# Altium project high_voltage_controller.PrjPcb (part 5 of 5)
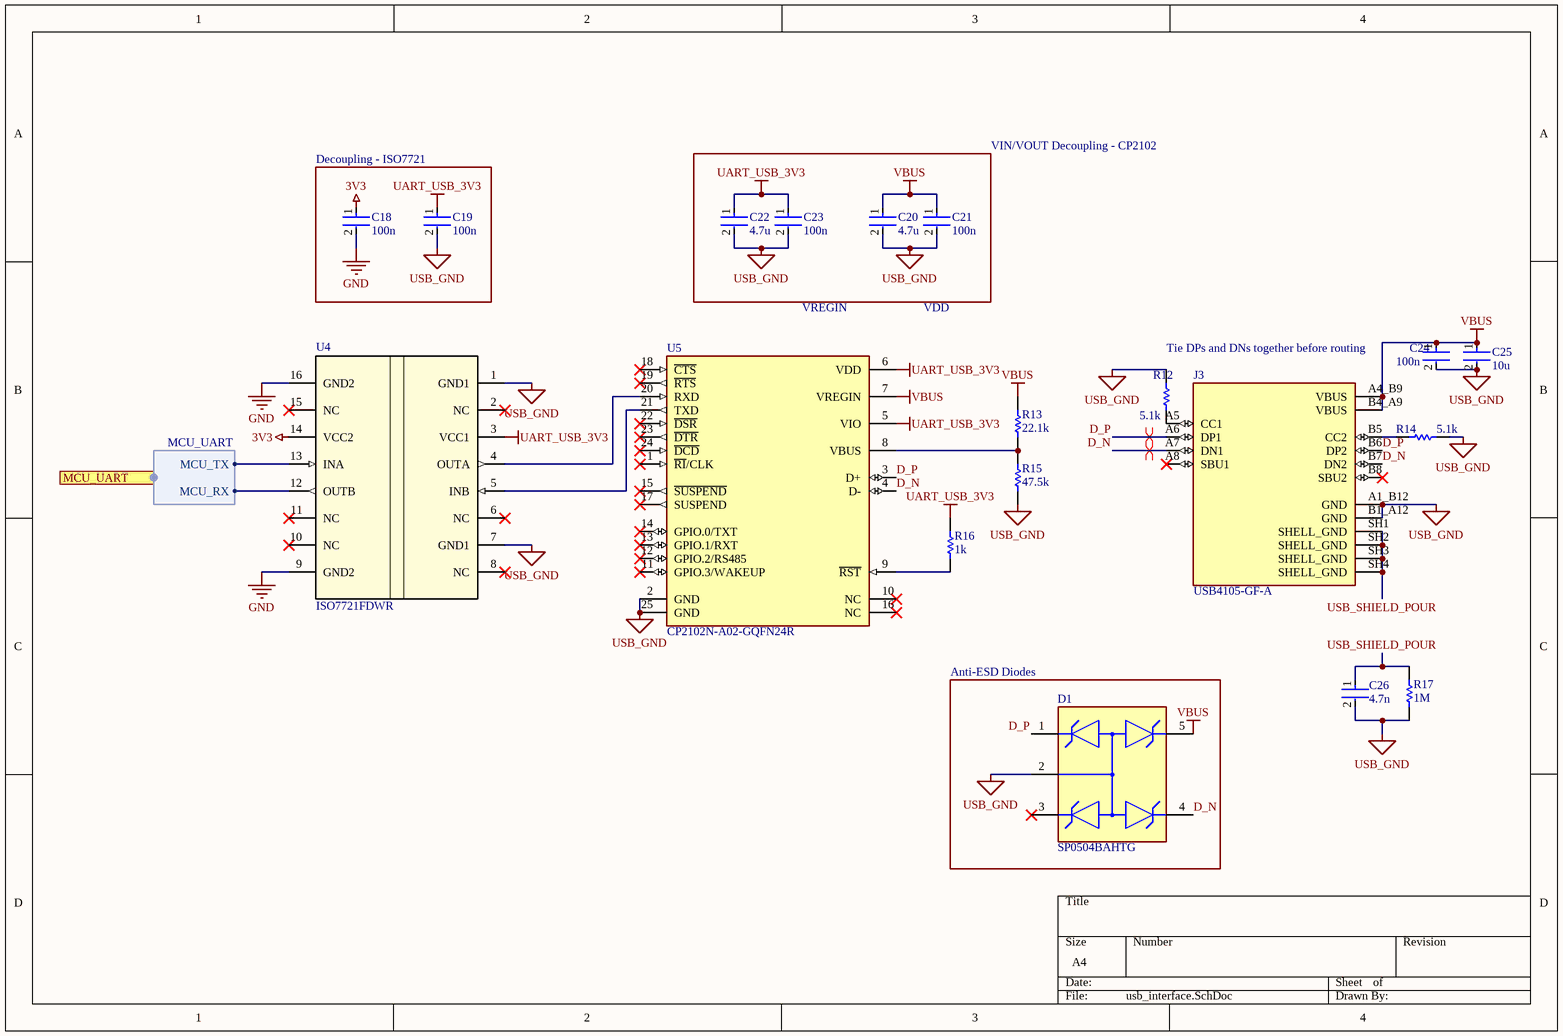
[diagram p7: usb_interface.SchDoc]

## Sheet usb_interface.SchDoc (continued)

### Library data of the parts (continued)
R17 = RC0805FR-071ML: 125mW Thick Film Resistors 150V ±100ppm/℃ ±1% 1MΩ 0805 Chip Resistor - Surface Mount ROHS; Manufacturer: Yageo Group; Temperature Coefficient: 100ppm/°C; Supplier: DigiKey; Supplier Part Number: 311-1.00MCRCT-ND; Manufacturer Part Number: RC0805FR-071ML; RoHS: Compliant; Category: Chip SMD Resistors; Stock: 235812; Pricing: 1=0.1, 10=0.034, 25=0.0256, 50=0.0208, 100=0.0171, 250=0.01344, 500=0.01136, 1000=0.00973 (USD); Case/Package: 0805; Case Code (Imperial): 0805; China RoHS: Non-Compliant; Composition: Thick Film; Contact Plating: Tin; Country of Origin: Mainland China, Taiwan; Depth: 1.25mm; Export Control Classification Number (ECCN) Code: EAR99; Features: Moisture Resistant; Height: 500µm; Harmonized Tariff Schedule (HTS) Code: 8533.21.00.30; Introduction Date: 2004-09-22; Lead Free: Lead Free; Length: 2mm; Lifecycle Status: Production; Max Operating Temperature: 155°C; Max Power Dissipation: 125mW; Military Standard: Not; Min Operating Temperature: -55°C; Mounting Technology: Surface Mount; Pins: 2; Number of Terminals: 2; Number of Terminations: 2; Packaging: Tape & Reel; Power Rating: 125mW; Radiation Hardening: No; REACH SVHC: Yes; Value: 1MΩ; Schedule B: 8533210045, 8533210045|8533210045, 8533210045|8533210045|8533210045, 8533210045|8533210045|8533210045|8533210045; Termination: SMD/SMT; Tolerance: 1%; Voltage Rating: 150V; Voltage Rating (AC): 150V; Voltage Rating (DC): 150V; Width: 1.25mm; Working Voltage: 150V; ComponentLink1URL: https://datasheet.octopart.com:443/RC0805FR-071ML-Yageo-datasheet-175887523.pdf?src-supplier=IHS; ComponentLink1Description: https://datasheet.octopart.com:443/RC0805FR-071ML-Yageo-datasheet-175887523.pdf?src-supplier=IHS; ComponentLink2URL: https://datasheet.octopart.com:443/RC0805FR-071ML-Yageo-datasheet-103092701.pdf?src-supplier=Upverter; ComponentLink2Description: https://datasheet.octopart.com:443/RC0805FR-071ML-Yageo-datasheet-103092701.pdf?src-supplier=Upverter; ComponentLink3URL: https://datasheet.octopart.com:443/RC0805FR-071ML-Yageo-datasheet-79472498.pdf?src-supplier=Upverter; ComponentLink3Description: https://datasheet.octopart.com:443/RC0805FR-071ML-Yageo-datasheet-79472498.pdf?src-supplier=Upverter; ComponentLink4URL: https://datasheet.octopart.com:443/RC0805FR-071ML-Yageo-datasheet-8330313.pdf?src-supplier=element14+APAC; ComponentLink4Description: https://datasheet.octopart.com:443/RC0805FR-071ML-Yageo-datasheet-8330313.pdf?src-supplier=element14+APAC; ComponentLink5URL: https://datasheet.octopart.com:443/RC0805FR-071ML-Yageo-Group-datasheet-190305687.pdf?src-supplier=Future+Electronics; ComponentLink5Description: https://datasheet.octopart.com:443/RC0805FR-071ML-Yageo-Group-datasheet-190305687.pdf?src-supplier=Future+Electronics; ComponentLink6URL: https://datasheet.octopart.com:443/RC0805FR-071ML-Yageo-datasheet-164759695.pdf?src-supplier=Future+Electronics; ComponentLink6Description: https://datasheet.octopart.com:443/RC0805FR-071ML-Yageo-datasheet-164759695.pdf?src-supplier=Future+Electronics; ComponentLink7URL: https://datasheet.octopart.com:443/RC0805FR-071ML-Yageo-datasheet-127823281.pdf?src-supplier=Future+Electronics; ComponentLink7Description: https://datasheet.octopart.com:443/RC0805FR-071ML-Yageo-datasheet-127823281.pdf?src-supplier=Future+Electronics; ComponentLink8URL: https://datasheet.octopart.com:443/RC0805FR-071ML-Yageo-datasheet-137700087.pdf?src-supplier=Future+Electronics; ComponentLink8Description: https://datasheet.octopart.com:443/RC0805FR-071ML-Yageo-datasheet-137700087.pdf?src-supplier=Future+Electronics; ComponentLink9URL: https://datasheet.octopart.com:443/RC0805FR-071ML-Yageo-datasheet-12592811.pdf?src-supplier=Future+Electronics; ComponentLink9Description: https://datasheet.octopart.com:443/RC0805FR-071ML-Yageo-datasheet-12592811.pdf?src-supplier=Future+Electronics; ComponentLink10URL: https://datasheet.octopart.com:443/RC0805FR-071ML-Yageo-datasheet-8324252.pdf?src-supplier=Future+Electronics; ComponentLink10Description: https://datasheet.octopart.com:443/RC0805FR-071ML-Yageo-datasheet-8324252.pdf?src-supplier=Future+Electronics; ComponentLink11URL: https://datasheet.octopart.com:443/RC0805FR-071ML-Yageo-datasheet-62067350.pdf?src-supplier=Farnell; ComponentLink11Description: https://datasheet.octopart.com:443/RC0805FR-071ML-Yageo-datasheet-62067350.pdf?src-supplier=Farnell; ComponentLink12URL: https://datasheet.octopart.com:443/RC0805FR-071ML-Yageo-datasheet-13691069.pdf?src-supplier=Farnell; ComponentLink12Description: https://datasheet.octopart.com:443/RC0805FR-071ML-Yageo-datasheet-13691069.pdf?src-supplier=Farnell; ComponentLink13URL: https://datasheet.octopart.com/RC0805FR-071ML-Yageo-datasheet-73766026.pdf; ComponentLink13Description: https://datasheet.octopart.com/RC0805FR-071ML-Yageo-datasheet-73766026.pdf; ComponentLink14URL: https://datasheet.octopart.com:443/RC0805FR-071ML-Yageo-datasheet-118657.pdf?src-supplier=DigiKey; ComponentLink14Description: https://datasheet.octopart.com:443/RC0805FR-071ML-Yageo-datasheet-118657.pdf?src-supplier=DigiKey; ComponentLink15URL: https://datasheet.octopart.com:443/RC0805FR-071ML-Yageo-datasheet-502840.pdf?src-supplier=element14; ComponentLink15Description: https://datasheet.octopart.com:443/RC0805FR-071ML-Yageo-datasheet-502840.pdf?src-supplier=element14; ComponentLink16URL: http://sigma.octopart.com:80/conflict_mineral_statement/Yageo-company-3.pdf?src-supplier=Compliance+Statements; ComponentLink16Description: http://sigma.octopart.com:80/conflict_mineral_statement/Yageo-company-3.pdf?src-supplier=Compliance+Statements; ComponentLink17URL: http://sigma.octopart.com:80/rohs_statement/Yageo-company-2.pdf?src-supplier=Compliance+Statements; ComponentLink17Description: http://sigma.octopart.com:80/rohs_statement/Yageo-company-2.pdf?src-supplier=Compliance+Statements; Supplier 1: DigiKey; Supplier Part Number 1: 311-1.00MCRCT-ND
U4 = ISO7721FDWR: Robust EMC, dual-channel, 1/1, reinforced digital isolator 16-SOIC -55 to 125; Manufacturer: Texas Instruments; Manufacturer Lifecycle Status: ACTIVE; Number of Channels: 2; Supplier: DigiKey; Supplier Part Number: 296-50346-1-ND; Manufacturer Part Number: ISO7721FDWR; RoHS: Compliant; Category: Digital Isolators; Stock: 15127; Pricing: 1=2.81, 10=2.094, 25=1.9152, 100=1.719, 250=1.62544, 500=1.5912 (USD); Case/Package: SOIC; Height: 2.65mm; Length: 10.3mm; Lifecycle Status: Production; Max Operating Temperature: 125°C; Min Operating Temperature: -55°C; Pins: 16; Schedule B: 8542390000; Thickness: 2.35mm; Width: 7.5mm; ComponentLink1URL: https://sigma.octopart.com:443/99572200/technical_drawing/Texas-Instruments-ISO7721FDWR.pdf?src-supplier=Texas+Instruments; ComponentLink1Description: https://sigma.octopart.com:443/99572200/technical_drawing/Texas-Instruments-ISO7721FDWR.pdf?src-supplier=Texas+Instruments; ComponentLink2URL: https://octopart.com:443/opatz8j6/c1?t=WZGGJDtRhiNR6xegtZ0Vzw6Jo8gIA4OkeL83hLNHBc3xALLZrOPA1KnNx-ec0I_-l9PCMZWyk75e5H8g6RMrJLmMNblHietK_abbQyImjN_oP_YsooAsDmW-v19do6DZ4jzx_Fx10KWDm9m_aOouo5hdul-hNs1fyUCmYsyFAGwxgQVoL5HSj0hs2mmPUZ1tA5owilxFZB39lP5Z4zu9Z-zIWmlA_gcYXWOi0ejZsd6FGsUjnxzOjqnuUWppL6xj46YVsAzbwlJm8vaSz28l_1Pzc2Ovu0xt7ToOzTyA-3S1SSaUiJRJiBHsaq__PSD3_uPcVRWFFlJ45olTYWRTRE-pIoFVMvQ4rQZJrKrEDyxEsTd4Z0hpONkN6dpwLsYRK33xwkk&src-supplier=Texas+Instruments; ComponentLink2Description: https://octopart.com:443/opatz8j6/c1?t=WZGGJDtRhiNR6xegtZ0Vzw6Jo8gIA4OkeL83hLNHBc3xALLZrOPA1KnNx-ec0I_-l9PCMZWyk75e5H8g6RMrJLmMNblHietK_abbQyImjN_oP_YsooAsDmW-v19do6DZ4jzx_Fx10KWDm9m_aOouo5hdul-hNs1fyUCmYsyFAGwxgQVoL5HSj0hs2mmPUZ1tA5owilxFZB39lP5Z4zu9Z-zIWmlA_gcYXWOi0ejZsd6FGsUjnxzOjqnuUWppL6xj46YVsAzbwlJm8vaSz28l_1Pzc2Ovu0xt7ToOzTyA-3S1SSaUiJRJiBHsaq__PSD3_uPcVRWFFlJ45olTYWRTRE-pIoFVMvQ4rQZJrKrEDyxEsTd4Z0hpONkN6dpwLsYRK33xwkk&src-supplier=Texas+Instruments; ComponentLink3URL: https://sigma.octopart.com:443/49250197/technical_drawing/Texas-Instruments-ISO7721FDWR.pdf?src-supplier=Texas+Instruments; ComponentLink3Description: https://sigma.octopart.com:443/49250197/technical_drawing/Texas-Instruments-ISO7721FDWR.pdf?src-supplier=Texas+Instruments; ComponentLink4URL: https://datasheet.octopart.com:443/ISO7721FDWR-Texas-Instruments-datasheet-164414773.pdf?src-supplier=Augswan; ComponentLink4Description: https://datasheet.octopart.com:443/ISO7721FDWR-Texas-Instruments-datasheet-164414773.pdf?src-supplier=Augswan; ComponentLink5URL: https://datasheet.octopart.com:443/ISO7721FDWR-Texas-Instruments-datasheet-82513802.pdf?src-supplier=HQonline; ComponentLink5Description: https://datasheet.octopart.com:443/ISO7721FDWR-Texas-Instruments-datasheet-82513802.pdf?src-supplier=HQonline; ComponentLink6URL: http://sigma.octopart.com:80/reach_statement/Texas-Instruments-company-64.pdf?src-supplier=Compliance+Statements; ComponentLink6Description: http://sigma.octopart.com:80/reach_statement/Texas-Instruments-company-64.pdf?src-supplier=Compliance+Statements; ComponentLink7URL: http://sigma.octopart.com:80/conflict_mineral_statement/Texas-Instruments-company-63.pdf?src-supplier=Compliance+Statements; ComponentLink7Description: http://sigma.octopart.com:80/conflict_mineral_statement/Texas-Instruments-company-63.pdf?src-supplier=Compliance+Statements; Supplier 1: DigiKey; Supplier Part Number 1: 296-50346-1-ND
U5 = CP2102N-A02-GQFN24R: IC Usb to Uart Bridge QFN24 / Usb Bridge, Usb to Uart Usb 2.0 Uart Interface 24-QFN (4X4); Manufacturer: Silicon Lab; Manufacturer Lifecycle Status: FULL PRODUCTION; Data Rate: 1.5Mbps; Max Junction Temperature (Tj): 105°C; Max Supply Voltage: 3.6V; Min Supply Voltage: 3V; Nominal Supply Voltage (DC): 3.3V; Number of Digital IO: 4; Supplier: DigiKey; Supplier Part Number: 336-5888-1-ND; Manufacturer Part Number: CP2102N-A02-GQFN24R; RoHS: Compliant; Category: USB Interface ICs; Stock: 19089; Pricing: 1=4.89, 10=3.699, 25=3.402, 100=3.0755, 250=2.9198, 500=2.82596 (USD); Ambient Temperature Range High: 85°C; China RoHS: Compliant; Height: 800µm; Height - Seated (Max): 800µm; Harmonized Tariff Schedule (HTS) Code: 8542.31.00.30; Interface: UART; Introduction Date: 2019-03-12; Length: 4mm; Lifecycle Status: Production; Max Operating Temperature: 85°C; Min Operating Temperature: -40°C; Number of Terminals: 24; REACH SVHC: Yes; Schedule B: 8542390000, 8542390000|8542390000|8542390000|8542390000|8542390000; Temperature Grade: Industrial; Terminal Pitch: 500µm; Width: 4mm; ComponentLink1URL: https://datasheet.octopart.com:443/CP2102N-A02-GQFN24R-Silicon-Labs-datasheet-138898368.pdf?src-supplier=SHENGYU+ELECTRONICS; ComponentLink1Description: https://datasheet.octopart.com:443/CP2102N-A02-GQFN24R-Silicon-Labs-datasheet-138898368.pdf?src-supplier=SHENGYU+ELECTRONICS; ComponentLink2URL: https://datasheet.octopart.com:443/CP2102N-A02-GQFN24R-Silicon-Labs-datasheet-166051788.pdf?src-supplier=Burklin+Elektronik; ComponentLink2Description: https://datasheet.octopart.com:443/CP2102N-A02-GQFN24R-Silicon-Labs-datasheet-166051788.pdf?src-supplier=Burklin+Elektronik; Supplier 1: DigiKey; Supplier Part Number 1: 336-5888-1-ND

## Sheet power.SchDoc
size A4; SheetNumber: 4; SheetTotal: 5
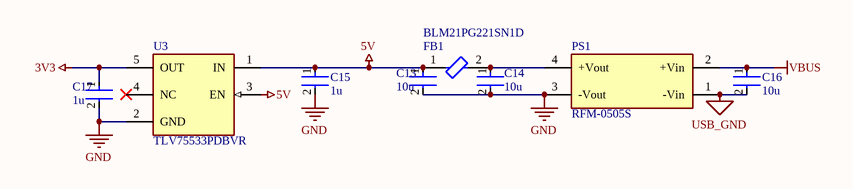
[diagram p4: power.SchDoc]

### Parts
C13  10u  [C_IM 0603]
C14  10u  [C_IM 0603]
C15  1u  [C_IM 0603]
C16  10u  [C_IM 0603]
C17  1u  [C_IM 0603]
FB1  BLM21PG221SN1D  [FB_IM 0805]
PS1  RFM-0505S  [4-SIP]
U3  TLV75533PDBVR  [SOT-23-5]

### Nets
3V3: C17.1 U3.5(OUT)
5V: C13.1 C15.1 FB1.1 U3.1(IN) U3.3(EN)
GND: C13.2 C14.2 C15.2 C17.2 PS1.3(-Vout) U3.2(GND)
USB_GND: C16.2 PS1.1(-Vin)
VBUS: C16.1 PS1.2(+Vin)
NetC14_1: C14.1 FB1.2 PS1.4(+Vout)

Not connected (* = marked no-connect by the designer): U3 4(NC)*

### Library data of the parts
C13 C14 C16 = CC0603MRX5R7BB106: Multilayer Ceramic Capacitors MLCC – SMD/SMT; YAGEO; CC0603MRX5R7BB106; 10 µF; 0603; 16 V; 16 V; Manufacturer: Yageo Group; Value: 10µF; Dielectric: X5R; Tolerance: 20%; Voltage Rating: 16V; Supplier: DigiKey; Supplier Part Number: 311-1822-1-ND; Manufacturer Part Number: CC0603MRX5R7BB106; RoHS: Compliant; Category: Ceramic Capacitors; Stock: 24512; Pricing: 1=0.41, 10=0.248, 50=0.1834, 100=0.1635, 500=0.13006, 1000=0.11973 (USD); Case/Package: 0603; Case Code (Imperial): 0603; Case Code (Metric): 1608; China RoHS: Compliant; Dielectric Material: Ceramic; Halogen Free: Halogen Free; Height: 800µm; Lead Free: Lead Free; Length: 1.6mm; Lifecycle Status: Production; Max Operating Temperature: 85°C; Min Operating Temperature: -55°C; Mounting Technology: Surface Mount; Number of Terminals: 2; Packaging: Tape & Reel (TR); REACH SVHC: Yes; Termination: SMD/SMT; Thickness: 889µm; Voltage Rating (DC): 16V; Weight: 2.012816mg; Width: 800µm; ComponentLink1URL: https://datasheet.octopart.com:443/CC0603MRX5R7BB106-Yageo-datasheet-170350636.pdf?src-supplier=IHS; ComponentLink1Description: https://datasheet.octopart.com:443/CC0603MRX5R7BB106-Yageo-datasheet-170350636.pdf?src-supplier=IHS; ComponentLink2URL: https://datasheet.octopart.com:443/CC0603MRX5R7BB106-Yageo-datasheet-182029744.pdf?src-supplier=Farnell; ComponentLink2Description: https://datasheet.octopart.com:443/CC0603MRX5R7BB106-Yageo-datasheet-182029744.pdf?src-supplier=Farnell; ComponentLink3URL: https://datasheet.octopart.com:443/CC0603MRX5R7BB106-Yageo-datasheet-182029743.pdf?src-supplier=Farnell; ComponentLink3Description: https://datasheet.octopart.com:443/CC0603MRX5R7BB106-Yageo-datasheet-182029743.pdf?src-supplier=Farnell; ComponentLink4URL: https://datasheet.octopart.com:443/CC0603MRX5R7BB106-Yageo-datasheet-158238148.pdf?src-supplier=JRH+Electronics; ComponentLink4Description: https://datasheet.octopart.com:443/CC0603MRX5R7BB106-Yageo-datasheet-158238148.pdf?src-supplier=JRH+Electronics; ComponentLink5URL: https://datasheet.octopart.com/CC0603MRX5R7BB106-Yageo-datasheet-86397281.pdf; ComponentLink5Description: https://datasheet.octopart.com/CC0603MRX5R7BB106-Yageo-datasheet-86397281.pdf; ComponentLink6URL: https://datasheet.octopart.com:443/CC0603MRX5R7BB106-Yageo-Group-datasheet-175963154.pdf?src-supplier=Newark; ComponentLink6Description: https://datasheet.octopart.com:443/CC0603MRX5R7BB106-Yageo-Group-datasheet-175963154.pdf?src-supplier=Newark; ComponentLink7URL: https://datasheet.octopart.com:443/CC0603MRX5R7BB106-Yageo-Group-datasheet-145016144.pdf?src-supplier=ODG+(Origin+Data+Global); ComponentLink7Description: https://datasheet.octopart.com:443/CC0603MRX5R7BB106-Yageo-Group-datasheet-145016144.pdf?src-supplier=ODG+(Origin+Data+Global); ComponentLink8URL: https://datasheet.octopart.com:443/CC0603MRX5R7BB106-Yageo-datasheet-137875056.pdf?src-supplier=Future+Electronics; ComponentLink8Description: https://datasheet.octopart.com:443/CC0603MRX5R7BB106-Yageo-datasheet-137875056.pdf?src-supplier=Future+Electronics; ComponentLink9URL: https://datasheet.octopart.com:443/CC0603MRX5R7BB106-Yageo-datasheet-78855687.pdf?src-supplier=Future+Electronics; ComponentLink9Description: https://datasheet.octopart.com:443/CC0603MRX5R7BB106-Yageo-datasheet-78855687.pdf?src-supplier=Future+Electronics; ComponentLink10URL: https://datasheet.octopart.com:443/CC0603MRX5R7BB106-Yageo-datasheet-62067349.pdf?src-supplier=Future+Electronics; ComponentLink10Description: https://datasheet.octopart.com:443/CC0603MRX5R7BB106-Yageo-datasheet-62067349.pdf?src-supplier=Future+Electronics; ComponentLink11URL: https://datasheet.octopart.com:443/CC0603MRX5R7BB106-Yageo-datasheet-68071816.pdf?src-supplier=Future+Electronics; ComponentLink11Description: https://datasheet.octopart.com:443/CC0603MRX5R7BB106-Yageo-datasheet-68071816.pdf?src-supplier=Future+Electronics; ComponentLink12URL: https://datasheet.octopart.com:443/CC0603MRX5R7BB106-Yageo-datasheet-68297942.pdf?src-supplier=Future+Electronics; ComponentLink12Description: https://datasheet.octopart.com:443/CC0603MRX5R7BB106-Yageo-datasheet-68297942.pdf?src-supplier=Future+Electronics; ComponentLink13URL: https://datasheet.octopart.com:443/CC0603MRX5R7BB106-Yageo-Group-datasheet-192360830.pdf?src-supplier=Future+Electronics; ComponentLink13Description: https://datasheet.octopart.com:443/CC0603MRX5R7BB106-Yageo-Group-datasheet-192360830.pdf?src-supplier=Future+Electronics; ComponentLink14URL: http://sigma.octopart.com:80/conflict_mineral_statement/Yageo-company-3.pdf?src-supplier=Compliance+Statements; ComponentLink14Description: http://sigma.octopart.com:80/conflict_mineral_statement/Yageo-company-3.pdf?src-supplier=Compliance+Statements; ComponentLink15URL: http://sigma.octopart.com:80/rohs_statement/Yageo-company-2.pdf?src-supplier=Compliance+Statements; ComponentLink15Description: http://sigma.octopart.com:80/rohs_statement/Yageo-company-2.pdf?src-supplier=Compliance+Statements; Supplier 1: DigiKey; Supplier Part Number 1: 311-1822-1-ND
C15 C17 = CC0603KRX7R7BB105: 16V 1uF X7R ±10% 0603 Multilayer Ceramic Capacitors MLCC - SMD/SMT ROHS; Manufacturer: Yageo Group; Value: 1µF; Dissipation Factor: 5%; Supplier: DigiKey; Supplier Part Number: 311-1446-1-ND; Manufacturer Part Number: CC0603KRX7R7BB105; RoHS: Compliant; Category: Ceramic Capacitors; Stock: 6886746; Pricing: 1=0.13, 10=0.073, 50=0.0508, 100=0.044, 500=0.0327, 1000=0.02922 (USD); Case/Package: 0603; Case Code (Imperial): 0603; Case Code (Metric): 1608; China RoHS: Compliant; Composition: Ceramic; Country of Origin: Mainland China, Taiwan; Depth: 800µm; Dielectric: X7R; Dielectric Material: Ceramic; Export Control Classification Number (ECCN) Code: EAR99; Halogen Free: Halogen Free; Height: 800µm; Harmonized Tariff Schedule (HTS) Code: 8532.24.00.20; Introduction Date: 2009-04-17; Lead Free: Lead Free; Length: 1.6mm; Lifecycle Status: Production; Material: Ceramic; Max Operating Temperature: 125°C; Min Operating Temperature: -55°C; Mounting Technology: Surface Mount; Pins: 2; Number of Terminals: 2; Radiation Hardening: No; REACH SVHC: Yes; Schedule B: 8532240020, 8532240020|8532240020, 8532240020|8532240020|8532240020, 8532240020|8532240020|8532240020|8532240020; Termination: SMD/SMT; Thickness: 889µm; Tolerance: 10%; Voltage: 16V; Voltage Rating: 16V; Voltage Rating (DC): 16V; Width: 800µm; ComponentLink1URL: https://datasheet.octopart.com:443/CC0603KRX7R7BB105-Yageo-datasheet-177165144.pdf?src-supplier=IHS; ComponentLink1Description: https://datasheet.octopart.com:443/CC0603KRX7R7BB105-Yageo-datasheet-177165144.pdf?src-supplier=IHS; ComponentLink2URL: https://datasheet.octopart.com:443/CC0603KRX7R7BB105-Yageo-datasheet-82288757.pdf?src-supplier=Upverter; ComponentLink2Description: https://datasheet.octopart.com:443/CC0603KRX7R7BB105-Yageo-datasheet-82288757.pdf?src-supplier=Upverter; ComponentLink3URL: https://datasheet.octopart.com/CC0603KRX7R7BB105-Yageo-datasheet-10883670.pdf; ComponentLink3Description: https://datasheet.octopart.com/CC0603KRX7R7BB105-Yageo-datasheet-10883670.pdf; ComponentLink4URL: https://datasheet.octopart.com/CC0603KRX7R7BB105-Yageo-datasheet-12526321.pdf; ComponentLink4Description: https://datasheet.octopart.com/CC0603KRX7R7BB105-Yageo-datasheet-12526321.pdf; ComponentLink5URL: https://datasheet.octopart.com:443/CC0603KRX7R7BB105-Yageo-datasheet-181968648.pdf?src-supplier=Newark; ComponentLink5Description: https://datasheet.octopart.com:443/CC0603KRX7R7BB105-Yageo-datasheet-181968648.pdf?src-supplier=Newark; ComponentLink6URL: https://datasheet.octopart.com:443/CC0603KRX7R7BB105-Yageo-datasheet-181968639.pdf?src-supplier=Newark; ComponentLink6Description: https://datasheet.octopart.com:443/CC0603KRX7R7BB105-Yageo-datasheet-181968639.pdf?src-supplier=Newark; ComponentLink7URL: https://datasheet.octopart.com:443/CC0603KRX7R7BB105-Yageo-datasheet-519481.pdf?src-supplier=Newark; ComponentLink7Description: https://datasheet.octopart.com:443/CC0603KRX7R7BB105-Yageo-datasheet-519481.pdf?src-supplier=Newark; ComponentLink8URL: https://datasheet.octopart.com:443/CC0603KRX7R7BB105-Yageo-datasheet-147453679.pdf?src-supplier=Newark; ComponentLink8Description: https://datasheet.octopart.com:443/CC0603KRX7R7BB105-Yageo-datasheet-147453679.pdf?src-supplier=Newark; ComponentLink9URL: https://datasheet.octopart.com:443/CC0603KRX7R7BB105-Yageo-datasheet-62336348.pdf?src-supplier=Farnell; ComponentLink9Description: https://datasheet.octopart.com:443/CC0603KRX7R7BB105-Yageo-datasheet-62336348.pdf?src-supplier=Farnell; ComponentLink10URL: https://datasheet.octopart.com:443/CC0603KRX7R7BB105-Yageo-datasheet-151948686.pdf?src-supplier=Farnell; ComponentLink10Description: https://datasheet.octopart.com:443/CC0603KRX7R7BB105-Yageo-datasheet-151948686.pdf?src-supplier=Farnell; ComponentLink11URL: https://datasheet.octopart.com:443/CC0603KRX7R7BB105-Yageo-datasheet-15895757.pdf?src-supplier=element14+APAC; ComponentLink11Description: https://datasheet.octopart.com:443/CC0603KRX7R7BB105-Yageo-datasheet-15895757.pdf?src-supplier=element14+APAC; ComponentLink12URL: https://datasheet.octopart.com:443/CC0603KRX7R7BB105-Yageo-datasheet-166511530.pdf?src-supplier=Future+Electronics; ComponentLink12Description: https://datasheet.octopart.com:443/CC0603KRX7R7BB105-Yageo-datasheet-166511530.pdf?src-supplier=Future+Electronics; ComponentLink13URL: https://datasheet.octopart.com:443/CC0603KRX7R7BB105-Yageo-datasheet-137700082.pdf?src-supplier=Future+Electronics; ComponentLink13Description: https://datasheet.octopart.com:443/CC0603KRX7R7BB105-Yageo-datasheet-137700082.pdf?src-supplier=Future+Electronics; ComponentLink14URL: https://datasheet.octopart.com:443/CC0603KRX7R7BB105-Yageo-datasheet-137700084.pdf?src-supplier=Future+Electronics; ComponentLink14Description: https://datasheet.octopart.com:443/CC0603KRX7R7BB105-Yageo-datasheet-137700084.pdf?src-supplier=Future+Electronics; ComponentLink15URL: https://datasheet.octopart.com:443/CC0603KRX7R7BB105-Yageo-datasheet-27626582.pdf?src-supplier=Future+Electronics; ComponentLink15Description: https://datasheet.octopart.com:443/CC0603KRX7R7BB105-Yageo-datasheet-27626582.pdf?src-supplier=Future+Electronics; ComponentLink16URL: https://datasheet.octopart.com:443/CC0603KRX7R7BB105-Yageo-Group-datasheet-165992755.pdf?src-supplier=ODG+(Origin+Data+Global); ComponentLink16Description: https://datasheet.octopart.com:443/CC0603KRX7R7BB105-Yageo-Group-datasheet-165992755.pdf?src-supplier=ODG+(Origin+Data+Global); ComponentLink17URL: https://datasheet.octopart.com:443/CC0603KRX7R7BB105-Yageo-datasheet-140260305.pdf?src-supplier=SOS+electronic; ComponentLink17Description: https://datasheet.octopart.com:443/CC0603KRX7R7BB105-Yageo-datasheet-140260305.pdf?src-supplier=SOS+electronic; ComponentLink18URL: https://datasheet.octopart.com:443/CC0603KRX7R7BB105-Yageo-datasheet-8701427.pdf?src-supplier=element14; ComponentLink18Description: https://datasheet.octopart.com:443/CC0603KRX7R7BB105-Yageo-datasheet-8701427.pdf?src-supplier=element14; ComponentLink19URL: https://datasheet.octopart.com:443/CC0603KRX7R7BB105-Yageo-datasheet-499490.pdf?src-supplier=element14; ComponentLink19Description: https://datasheet.octopart.com:443/CC0603KRX7R7BB105-Yageo-datasheet-499490.pdf?src-supplier=element14; ComponentLink20URL: https://datasheet.octopart.com:443/CC0603KRX7R7BB105-Yageo-datasheet-5301394.pdf?src-supplier=element14; ComponentLink20Description: https://datasheet.octopart.com:443/CC0603KRX7R7BB105-Yageo-datasheet-5301394.pdf?src-supplier=element14; ComponentLink21URL: https://datasheet.octopart.com:443/CC0603KRX7R7BB105-Yageo-datasheet-17600895.pdf?src-supplier=TME; ComponentLink21Description: https://datasheet.octopart.com:443/CC0603KRX7R7BB105-Yageo-datasheet-17600895.pdf?src-supplier=TME; ComponentLink22URL: http://sigma.octopart.com:80/rohs_statement/Surface-Mount-Ceramic-Multilayer-Capacitors%3B-General-Purpose-%26-High-Capacitance-Class-2%2C-X7R-Yageo-family-124.pdf?src-supplier=Compliance+Statements; ComponentLink22Description: http://sigma.octopart.com:80/rohs_statement/Surface-Mount-Ceramic-Multilayer-Capacitors%3B-General-Purpose-%26-High-Capacitance-Class-2%2C-X7R-Yageo-family-124.pdf?src-supplier=Compliance+Statements; ComponentLink23URL: http://sigma.octopart.com:80/reach_statement/Surface-Mount-Ceramic-Multilayer-Capacitors%3B-General-Purpose-%26-High-Capacitance-Class-2%2C-X7R-Yageo-family-125.pdf?src-supplier=Compliance+Statements; ComponentLink23Description: http://sigma.octopart.com:80/reach_statement/Surface-Mount-Ceramic-Multilayer-Capacitors%3B-General-Purpose-%26-High-Capacitance-Class-2%2C-X7R-Yageo-family-125.pdf?src-supplier=Compliance+Statements; ComponentLink24URL: http://sigma.octopart.com:80/conflict_mineral_statement/Yageo-company-3.pdf?src-supplier=Compliance+Statements; ComponentLink24Description: http://sigma.octopart.com:80/conflict_mineral_statement/Yageo-company-3.pdf?src-supplier=Compliance+Statements; ComponentLink25URL: http://sigma.octopart.com:80/rohs_statement/Yageo-company-2.pdf?src-supplier=Compliance+Statements; ComponentLink25Description: http://sigma.octopart.com:80/rohs_statement/Yageo-company-2.pdf?src-supplier=Compliance+Statements; Supplier 1: DigiKey; Supplier Part Number 1: 311-1446-1-ND
FB1 = BLM21PG221SN1D: Ferrite Beads Multi-Layer 220Ohm 25% 100MHz 2A 45mOhm DCR 0805 Paper T/R; Manufacturer: Murata; Manufacturer Package Identifier: 0805 (2012 metric); DC Resistance (DCR): 50mΩ; Impedance: 220Ω; Material: Ferrite, Steel; Number of Circuits: 1; Value: 220Ω; ESR: 45mΩ; Shielding: Unshielded; Supplier: DigiKey; Supplier Part Number: 490-1054-1-ND; Manufacturer Part Number: BLM21PG221SN1D; RoHS: Compliant; Category: Ferrite Beads and Chips; Stock: 1304596; Pricing: 1=0.11, 10=0.08, 25=0.0696, 50=0.0626, 100=0.0561, 250=0.04828, 500=0.0429, 1000=0.03791 (USD); Case/Package: 0805; Case Code (Imperial): 0805; Case Code (Metric): 2012; Contact Plating: Tin; Core Material: Ferrite; Current: 2A; Current Rating: 2A; DC Current: 2A; Depth: 1.25mm; Frequency: 100MHz; Height: 850µm; Lead Free: Lead Free; Length: 2mm; Lifecycle Status: Production; Max Current Rating: 2A; Max DC Current: 2A; Clock Frequency: 100MHz; Max Operating Temperature: 125°C; Military Standard: Not; Min Operating Temperature: -55°C; Mounting Technology: Surface Mount; Number of Lines: 1; Pins: 2; Number of Terminals: 2; Packaging: Tape and Reel; Radiation Hardening: No; REACH SVHC: Yes; RMS Current (Irms): 2A; Schedule B: 8504500000, 8504500000|8504500000|8504500000|8504500000|8504500000; Termination: SMD/SMT; Test Frequency: 100MHz; Tolerance: 25%; Width: 1.25mm; ComponentLink1URL: https://datasheet.octopart.com:443/BLM21PG221SN1D-Murata-datasheet-114786051.pdf?src-supplier=Upverter; ComponentLink1Description: https://datasheet.octopart.com:443/BLM21PG221SN1D-Murata-datasheet-114786051.pdf?src-supplier=Upverter; ComponentLink2URL: https://datasheet.octopart.com:443/BLM21PG221SN1D-Murata-datasheet-12522583.pdf?src-supplier=Upverter; ComponentLink2Description: https://datasheet.octopart.com:443/BLM21PG221SN1D-Murata-datasheet-12522583.pdf?src-supplier=Upverter; ComponentLink3URL: https://datasheet.octopart.com:443/BLM21PG221SN1D-Murata-datasheet-10083551.pdf?src-supplier=Upverter; ComponentLink3Description: https://datasheet.octopart.com:443/BLM21PG221SN1D-Murata-datasheet-10083551.pdf?src-supplier=Upverter; ComponentLink4URL: https://datasheet.octopart.com:443/BLM21PG221SN1D-Murata-datasheet-8508678.pdf?src-supplier=Upverter; ComponentLink4Description: https://datasheet.octopart.com:443/BLM21PG221SN1D-Murata-datasheet-8508678.pdf?src-supplier=Upverter; ComponentLink5URL: https://datasheet.octopart.com:443/BLM21PG221SN1D-Murata-datasheet-166171482.pdf?src-supplier=IHS; ComponentLink5Description: https://datasheet.octopart.com:443/BLM21PG221SN1D-Murata-datasheet-166171482.pdf?src-supplier=IHS; ComponentLink6URL: https://datasheet.octopart.com:443/BLM21PG221SN1D-Murata-datasheet-11743916.pdf?src-supplier=SOS+electronic; ComponentLink6Description: https://datasheet.octopart.com:443/BLM21PG221SN1D-Murata-datasheet-11743916.pdf?src-supplier=SOS+electronic; ComponentLink7URL: https://datasheet.octopart.com:443/BLM21PG221SN1D-Murata-datasheet-37129980.pdf?src-supplier=element14+APAC; ComponentLink7Description: https://datasheet.octopart.com:443/BLM21PG221SN1D-Murata-datasheet-37129980.pdf?src-supplier=element14+APAC; ComponentLink8URL: https://datasheet.octopart.com:443/BLM21PG221SN1D-Murata-datasheet-53019.pdf?src-supplier=TME; ComponentLink8Description: https://datasheet.octopart.com:443/BLM21PG221SN1D-Murata-datasheet-53019.pdf?src-supplier=TME; ComponentLink9URL: https://datasheet.octopart.com:443/BLM21PG221SN1D-Murata-datasheet-135086726.pdf?src-supplier=TME; ComponentLink9Description: https://datasheet.octopart.com:443/BLM21PG221SN1D-Murata-datasheet-135086726.pdf?src-supplier=TME; ComponentLink10URL: https://datasheet.octopart.com:443/BLM21PG221SN1D-Murata-datasheet-8359900.pdf?src-supplier=_legacy+Avnet; ComponentLink10Description: https://datasheet.octopart.com:443/BLM21PG221SN1D-Murata-datasheet-8359900.pdf?src-supplier=_legacy+Avnet; ComponentLink11URL: https://datasheet.octopart.com:443/BLM21PG221SN1D-Murata-datasheet-554271.pdf?src-supplier=_legacy+Avnet; ComponentLink11Description: https://datasheet.octopart.com:443/BLM21PG221SN1D-Murata-datasheet-554271.pdf?src-supplier=_legacy+Avnet; ComponentLink12URL: https://datasheet.octopart.com:443/BLM21PG221SN1D-Murata-datasheet-141258121.pdf?src-supplier=Ciiva; ComponentLink12Description: https://datasheet.octopart.com:443/BLM21PG221SN1D-Murata-datasheet-141258121.pdf?src-supplier=Ciiva; ComponentLink13URL: https://datasheet.octopart.com:443/BLM21PG221SN1D-Murata-datasheet-138707416.pdf?src-supplier=Ciiva; ComponentLink13Description: https://datasheet.octopart.com:443/BLM21PG221SN1D-Murata-datasheet-138707416.pdf?src-supplier=Ciiva; ComponentLink14URL: https://datasheet.octopart.com:443/BLM21PG221SN1D-Murata-datasheet-83134203.pdf?src-supplier=Megastar; ComponentLink14Description: https://datasheet.octopart.com:443/BLM21PG221SN1D-Murata-datasheet-83134203.pdf?src-supplier=Megastar; ComponentLink15URL: https://datasheet.octopart.com:443/BLM21PG221SN1D-Murata-datasheet-62086381.pdf?src-supplier=Future+Electronics; ComponentLink15Description: https://datasheet.octopart.com:443/BLM21PG221SN1D-Murata-datasheet-62086381.pdf?src-supplier=Future+Electronics; ComponentLink16URL: https://datasheet.octopart.com:443/BLM21PG221SN1D-Murata-datasheet-14066484.pdf?src-supplier=iiiC; ComponentLink16Description: https://datasheet.octopart.com:443/BLM21PG221SN1D-Murata-datasheet-14066484.pdf?src-supplier=iiiC; ComponentLink17URL: https://datasheet.octopart.com:443/BLM21PG221SN1D-Murata-datasheet-8197962.pdf?src-supplier=Jameco; ComponentLink17Description: https://datasheet.octopart.com:443/BLM21PG221SN1D-Murata-datasheet-8197962.pdf?src-supplier=Jameco; ComponentLink18URL: https://datasheet.octopart.com:443/BLM21PG221SN1D-Murata-datasheet-153769.pdf?src-supplier=Mouser; ComponentLink18Description: https://datasheet.octopart.com:443/BLM21PG221SN1D-Murata-datasheet-153769.pdf?src-supplier=Mouser; ComponentLink19URL: http://sigma.octopart.com:80/reach_statement/Murata-company-16.pdf?src-supplier=Compliance+Statements; ComponentLink19Description: http://sigma.octopart.com:80/reach_statement/Murata-company-16.pdf?src-supplier=Compliance+Statements; Supplier 1: DigiKey; Supplier Part Number 1: 490-1054-1-ND
PS1 = RFM-0505S: DC DC CONVERTER 5V 1W / Isolated Module DC DC Converter 1 Output 5V 200mA - 5V Input; Manufacturer: Recom Power; Max Supply Voltage: 5.5V; Max Output Voltage: 5.25V; Min Input Voltage: 4.5V; Min Output Voltage: 4.75V; Nominal Supply Current: 25mA; Number of Circuits: 1; Switching Frequency: 80kHz; Supplier: DigiKey; Supplier Part Number: 945-3159-ND; Manufacturer Part Number: RFM-0505S; RoHS: Compliant; Category: Voltage Regulators - Switching; Stock: 10396; Pricing: 1=1.96, 5=1.892, 10=1.861, 25=1.8212, 50=1.7918, 100=1.7628, 250=1.72512, 500=1.69706 (USD); Case/Package: SMA; Composition: Hybrid; Height: 10mm; Height - Seated (Max): 10.5mm; Length: 11.5mm; Lifecycle Status: Production; Max Operating Temperature: 85°C; Max Output Power: 1W; Max Power Dissipation: 1W; Min Operating Temperature: -40°C; Min Supply Voltage: 4.5V; Nominal Supply Voltage: 5V; Nominal Output Voltage: 5V; Number of Outputs: 1; Number of Terminals: 4; Output Current: 200mA; Output Power: 1W; Output Voltage: 5V; REACH SVHC: Yes; Schedule B: 8504409580, 8504409580|8504409580|8504409580|8504409580|8504409580; Temperature Grade: Industrial; Terminal Pitch: 2.54mm; Weight: 1.4g; Width: 6mm; ComponentLink1URL: https://datasheet.octopart.com:443/RFM-0505S-Recom-Power-datasheet-133924900.pdf?src-supplier=Farnell; ComponentLink1Description: https://datasheet.octopart.com:443/RFM-0505S-Recom-Power-datasheet-133924900.pdf?src-supplier=Farnell; ComponentLink2URL: https://datasheet.octopart.com:443/RFM-0505S-Recom-Power-datasheet-104425650.pdf?src-supplier=element14+APAC; ComponentLink2Description: https://datasheet.octopart.com:443/RFM-0505S-Recom-Power-datasheet-104425650.pdf?src-supplier=element14+APAC; Supplier 1: Future Electronics; Supplier Part Number 1: RFM-0505S
U3 = TLV75533PDBVR: 500mA high-PSRR low-IQ low-dropout voltage regulator with enable 5-SOT-23 -40 to 125; Manufacturer: Texas Instruments; Manufacturer Lifecycle Status: ACTIVE; Accuracy: 1%; Dropout Voltage: 150mV; Max Junction Temperature (Tj): 125°C; Max Supply Voltage: 5.5V; Min Supply Voltage: 1.45V; Number of Channels: 1; Output Voltage: 3.3V; Supplier: DigiKey; Supplier Part Number: 296-50411-1-ND; Manufacturer Part Number: TLV75533PDBVR; RoHS: Compliant; Category: LDO Voltage Regulators; Stock: 109318; Pricing: 1=0.42, 10=0.293, 25=0.2612, 100=0.226, 250=0.20924, 500=0.19914, 1000=0.1908 (USD); Ambient Temperature Range High: 70°C; Case/Package: SOT-23; Height: 1.45mm; Length: 2.9mm; Lifecycle Status: Production; Max Operating Temperature: 125°C; Min Operating Temperature: -40°C; Number of Outputs: 1; Pins: 5; Output Current: 500mA; Schedule B: 8542390000; Thickness: 1.2mm; Width: 1.6mm; ComponentLink1URL: https://sigma.octopart.com:443/177332311/technical_drawing/Texas-Instruments-TLV75533PDBVR.pdf?src-supplier=Texas+Instruments; ComponentLink1Description: https://sigma.octopart.com:443/177332311/technical_drawing/Texas-Instruments-TLV75533PDBVR.pdf?src-supplier=Texas+Instruments; ComponentLink2URL: https://octopart.com:443/opatz8j6/c1?t=pJCVaXVeocVDo2Na9Kz930KxP9WlbiHXFzp-cQRqTk1WLxn6m8yxr6zxC1qRiDO0P_B3TiiuwP3Uo1LDv2eRfTeEuBJrPQF3Oh-DFONYjT4exTF0sQ6pd-H5AatGceck4ln_JcF3-R-BErslWVzv623L6IukQ_TOt0x7LXU8RILPbqx6us3vBntWGrun-G6tr_IHIxh-feVSoK34ieYhQ_JVJrErYkpsrpwqVOt_yyM0k7uf37aToqtChFiZzNVVy5WYj6k7cBc_KdiLCxhvxPtOSSpNghqOyQUHV-_rQVYn-daD9p5-KiJBmOr9BwrYpLpqUfPHDzEwZhbVwq2n-NV-PEE87B7xehb_44GvCcMDZl8973qxGpT8jPpN2VSikqP0OFo&src-supplier=Texas+Instruments; ComponentLink2Description: https://octopart.com:443/opatz8j6/c1?t=pJCVaXVeocVDo2Na9Kz930KxP9WlbiHXFzp-cQRqTk1WLxn6m8yxr6zxC1qRiDO0P_B3TiiuwP3Uo1LDv2eRfTeEuBJrPQF3Oh-DFONYjT4exTF0sQ6pd-H5AatGceck4ln_JcF3-R-BErslWVzv623L6IukQ_TOt0x7LXU8RILPbqx6us3vBntWGrun-G6tr_IHIxh-feVSoK34ieYhQ_JVJrErYkpsrpwqVOt_yyM0k7uf37aToqtChFiZzNVVy5WYj6k7cBc_KdiLCxhvxPtOSSpNghqOyQUHV-_rQVYn-daD9p5-KiJBmOr9BwrYpLpqUfPHDzEwZhbVwq2n-NV-PEE87B7xehb_44GvCcMDZl8973qxGpT8jPpN2VSikqP0OFo&src-supplier=Texas+Instruments; ComponentLink3URL: https://sigma.octopart.com:443/175570406/technical_drawing/Texas-Instruments-TLV75533PDBVR.pdf?src-supplier=Texas+Instruments; ComponentLink3Description: https://sigma.octopart.com:443/175570406/technical_drawing/Texas-Instruments-TLV75533PDBVR.pdf?src-supplier=Texas+Instruments; ComponentLink4URL: https://sigma.octopart.com:443/169406034/technical_drawing/Texas-Instruments-TLV75533PDBVR.pdf?src-supplier=Texas+Instruments; ComponentLink4Description: https://sigma.octopart.com:443/169406034/technical_drawing/Texas-Instruments-TLV75533PDBVR.pdf?src-supplier=Texas+Instruments; ComponentLink5URL: https://sigma.octopart.com:443/155939316/technical_drawing/Texas-Instruments-TLV75533PDBVR.pdf?src-supplier=Texas+Instruments; ComponentLink5Description: https://sigma.octopart.com:443/155939316/technical_drawing/Texas-Instruments-TLV75533PDBVR.pdf?src-supplier=Texas+Instruments; ComponentLink6URL: https://sigma.octopart.com:443/102331370/technical_drawing/Texas-Instruments-TLV75533PDBVR.pdf?src-supplier=Texas+Instruments; ComponentLink6Description: https://sigma.octopart.com:443/102331370/technical_drawing/Texas-Instruments-TLV75533PDBVR.pdf?src-supplier=Texas+Instruments; ComponentLink7URL: https://datasheet.octopart.com:443/TLV75533PDBVR-Texas-Instruments-datasheet-150455022.pdf?src-supplier=Augswan; ComponentLink7Description: https://datasheet.octopart.com:443/TLV75533PDBVR-Texas-Instruments-datasheet-150455022.pdf?src-supplier=Augswan; ComponentLink8URL: https://datasheet.octopart.com:443/TLV75533PDBVR-Texas-Instruments-datasheet-165804640.pdf?src-supplier=LCSC; ComponentLink8Description: https://datasheet.octopart.com:443/TLV75533PDBVR-Texas-Instruments-datasheet-165804640.pdf?src-supplier=LCSC; ComponentLink9URL: https://datasheet.octopart.com:443/TLV75533PDBVR-Texas-Instruments-datasheet-159117836.pdf?src-supplier=LCSC; ComponentLink9Description: https://datasheet.octopart.com:443/TLV75533PDBVR-Texas-Instruments-datasheet-159117836.pdf?src-supplier=LCSC; ComponentLink10URL: http://sigma.octopart.com:80/reach_statement/Texas-Instruments-company-64.pdf?src-supplier=Compliance+Statements; ComponentLink10Description: http://sigma.octopart.com:80/reach_statement/Texas-Instruments-company-64.pdf?src-supplier=Compliance+Statements; ComponentLink11URL: http://sigma.octopart.com:80/conflict_mineral_statement/Texas-Instruments-company-63.pdf?src-supplier=Compliance+Statements; ComponentLink11Description: http://sigma.octopart.com:80/conflict_mineral_statement/Texas-Instruments-company-63.pdf?src-supplier=Compliance+Statements; Supplier 1: DigiKey; Supplier Part Number 1: 296-50411-6-ND

## Nets that join several sheets
3V3: mcu (11 pins), usb_interface (C18.1 U4.14), power (C17.1 U3.5)
5V: supply_interface (C12.1 U2.8), power (5 pins)
GND: mcu (18 pins), supply_interface (15 pins), usb_interface (C18.2 U4.9 U4.16), power (6 pins)
USB_GND: usb_interface (19 pins), power (C16.2 PS1.1)
VBUS: usb_interface (9 pins), power (C16.1 PS1.2)
NetQ1_1: mcu (U1.11), supply_interface (Q1.1)
NetQ2_1: mcu (U1.14), supply_interface (Q2.1)
NetQ3_1: mcu (U1.10), supply_interface (Q3.1)
NetR3_1: mcu (U1.8), supply_interface (R3.1 R4.2)
NetR5_2: mcu (U1.9), supply_interface (R5.2 R6.2)
NetU1_12: mcu (U1.12), supply_interface (U2.5)
NetU1_13: mcu (U1.13), supply_interface (U2.3)
NetU1_31: mcu (U1.31), usb_interface (U4.13)
NetU1_32: mcu (U1.32), usb_interface (U4.12)